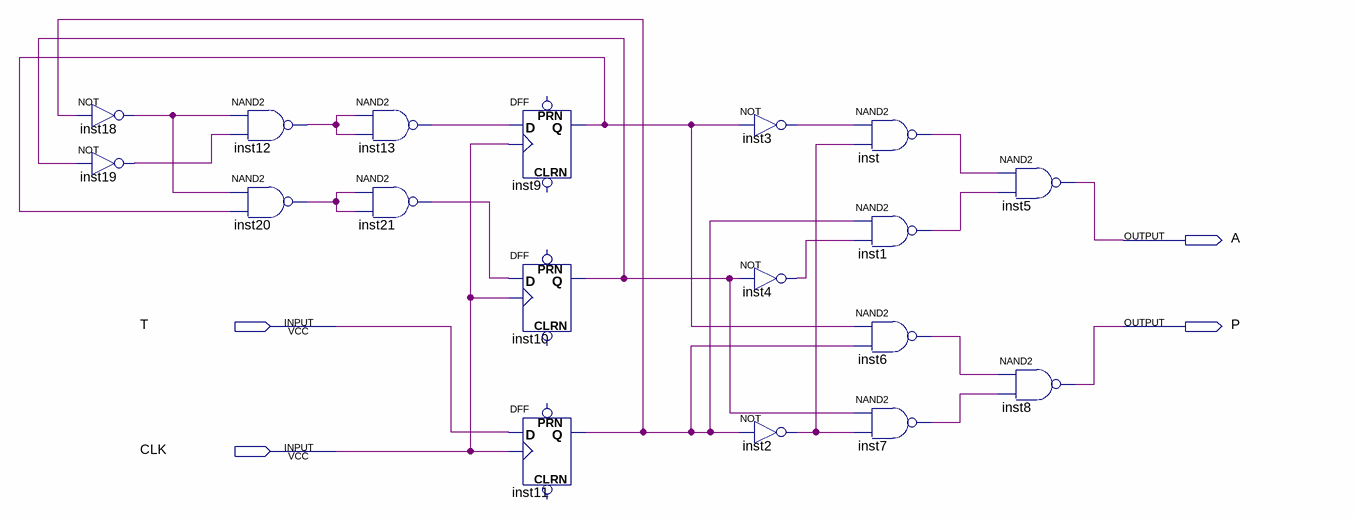
[diagram p0: schematic sheet]
// Quartus schematic Block3.bdf as structural Verilog: 18 symbols, 4 pins
module Block3 (
  input  T,
  input  CLK,
  output A,
  output P
);

  wire inst1_out, inst2_out, inst3_out, inst4_out, inst6_out, inst7_out, inst9_q, inst10_q, inst11_q,
       inst12_out, inst13_out, inst18_out, inst19_out, inst20_out, inst21_out, inst_out;

  not inst18 (inst18_out, inst11_q);
  not inst19 (inst19_out, inst10_q);
  nand inst12 (inst12_out, inst18_out, inst19_out);
  nand inst20 (inst20_out, inst18_out, inst9_q);
  nand inst13 (inst13_out, inst12_out, inst12_out);
  nand inst21 (inst21_out, inst20_out, inst20_out);
  DFF inst9 (.CLK(CLK), .D(inst13_out), .Q(inst9_q));  // open: CLRN, PRN
  DFF inst10 (.CLK(CLK), .D(inst21_out), .Q(inst10_q));  // open: CLRN, PRN
  DFF inst11 (.CLK(CLK), .D(T), .Q(inst11_q));  // open: CLRN, PRN
  not inst3 (inst3_out, inst9_q);
  not inst4 (inst4_out, inst10_q);
  not inst2 (inst2_out, inst11_q);
  nand inst (inst_out, inst3_out, inst2_out);
  nand inst1 (inst1_out, inst11_q, inst4_out);
  nand inst6 (inst6_out, inst9_q, inst11_q);
  nand inst7 (inst7_out, inst10_q, inst2_out);
  nand inst5 (A, inst_out, inst1_out);
  nand inst8 (P, inst6_out, inst7_out);
endmodule
